# EAGLE design PiDriverV3 (EAGLE 6.4)
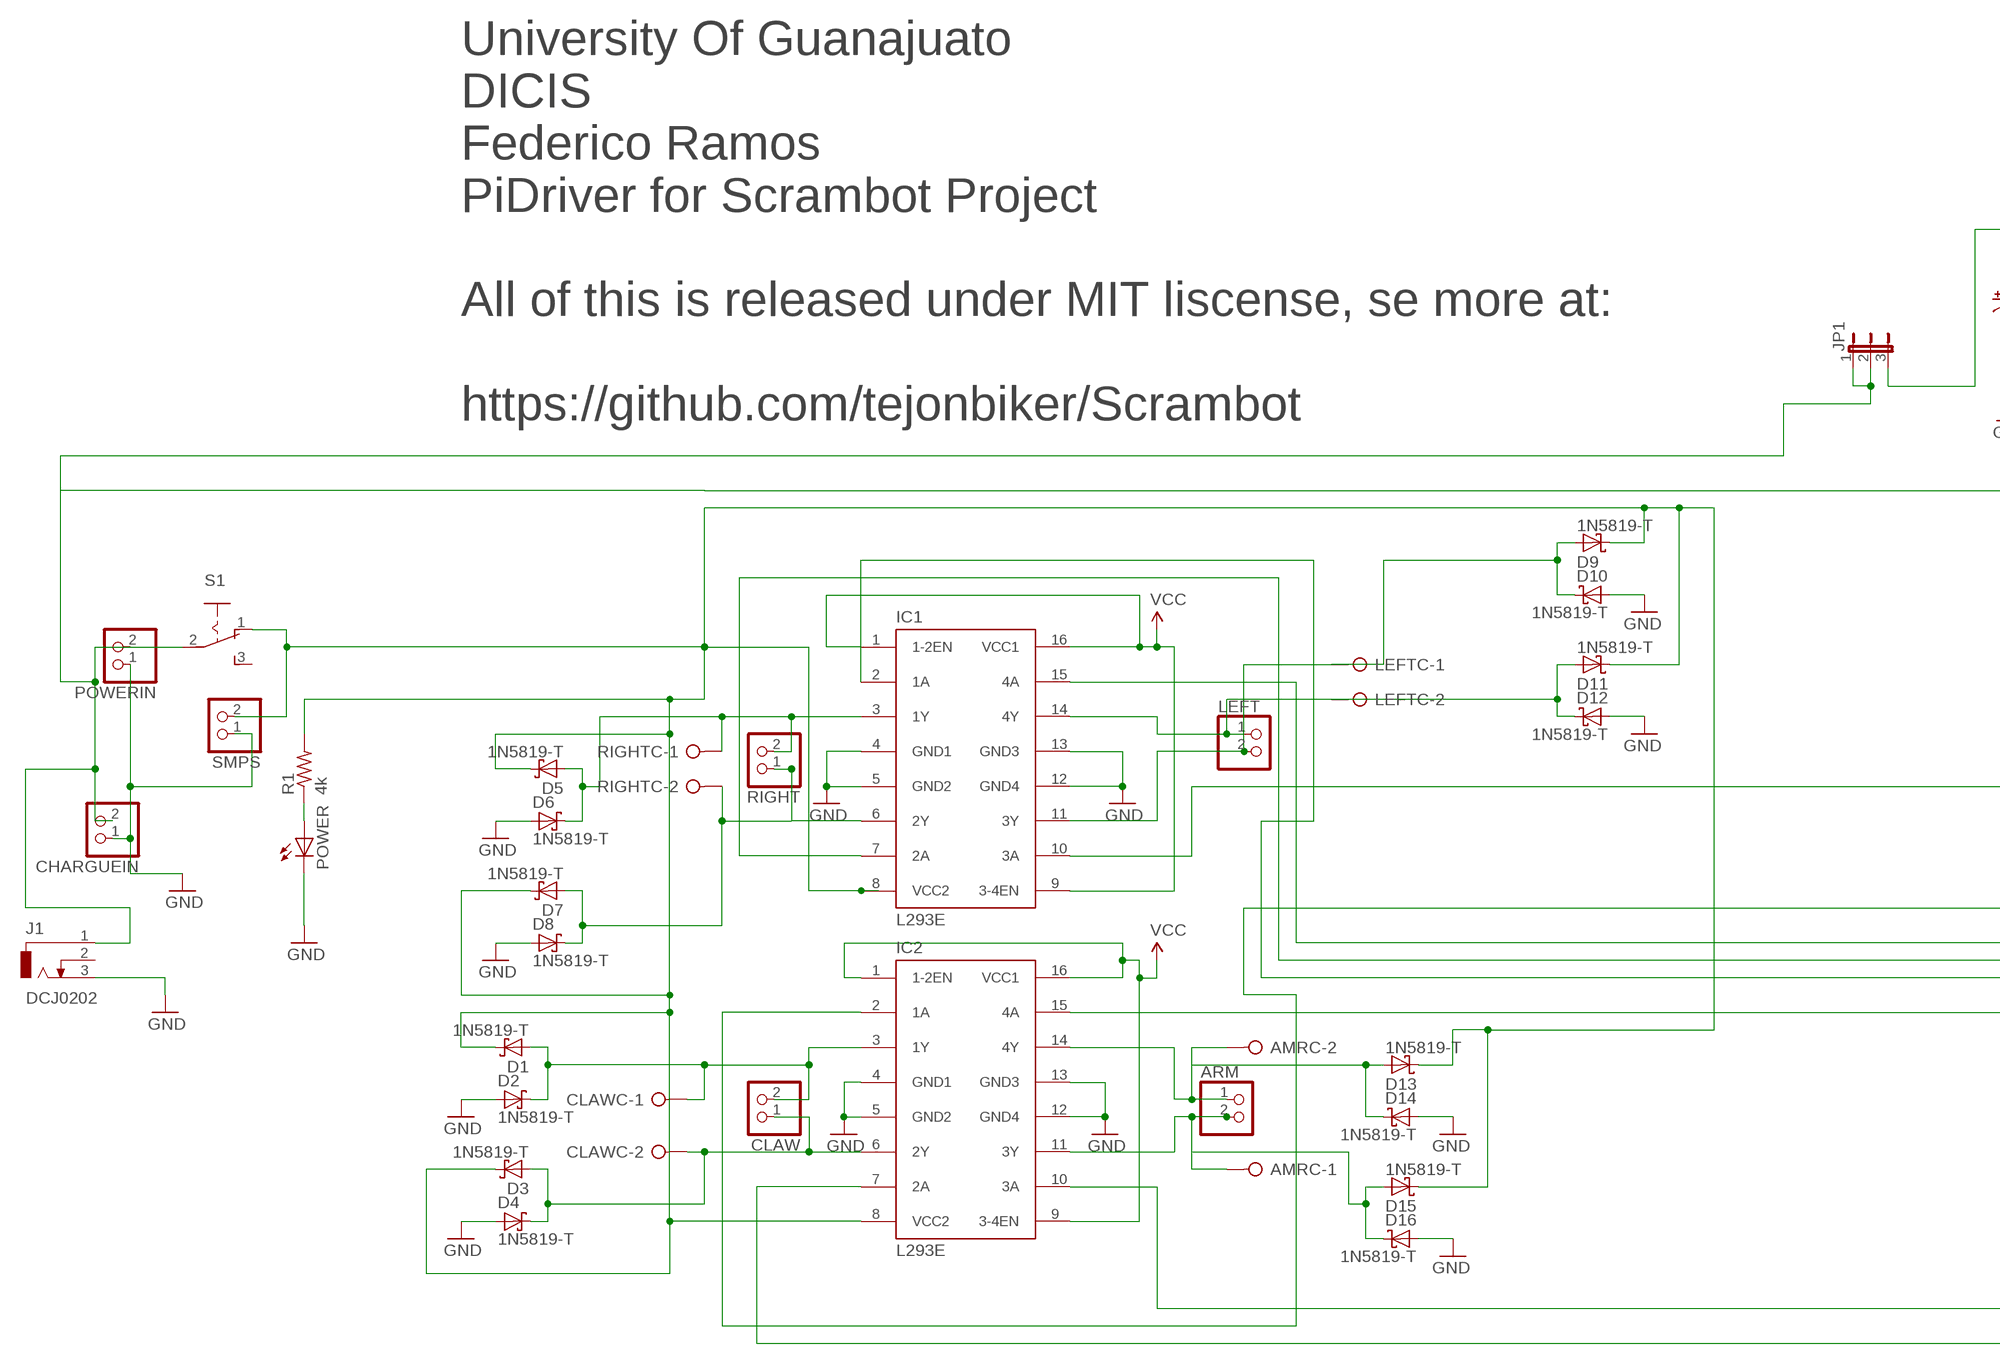
[diagram p0: schematic, sheet 1, part 1 of 2]
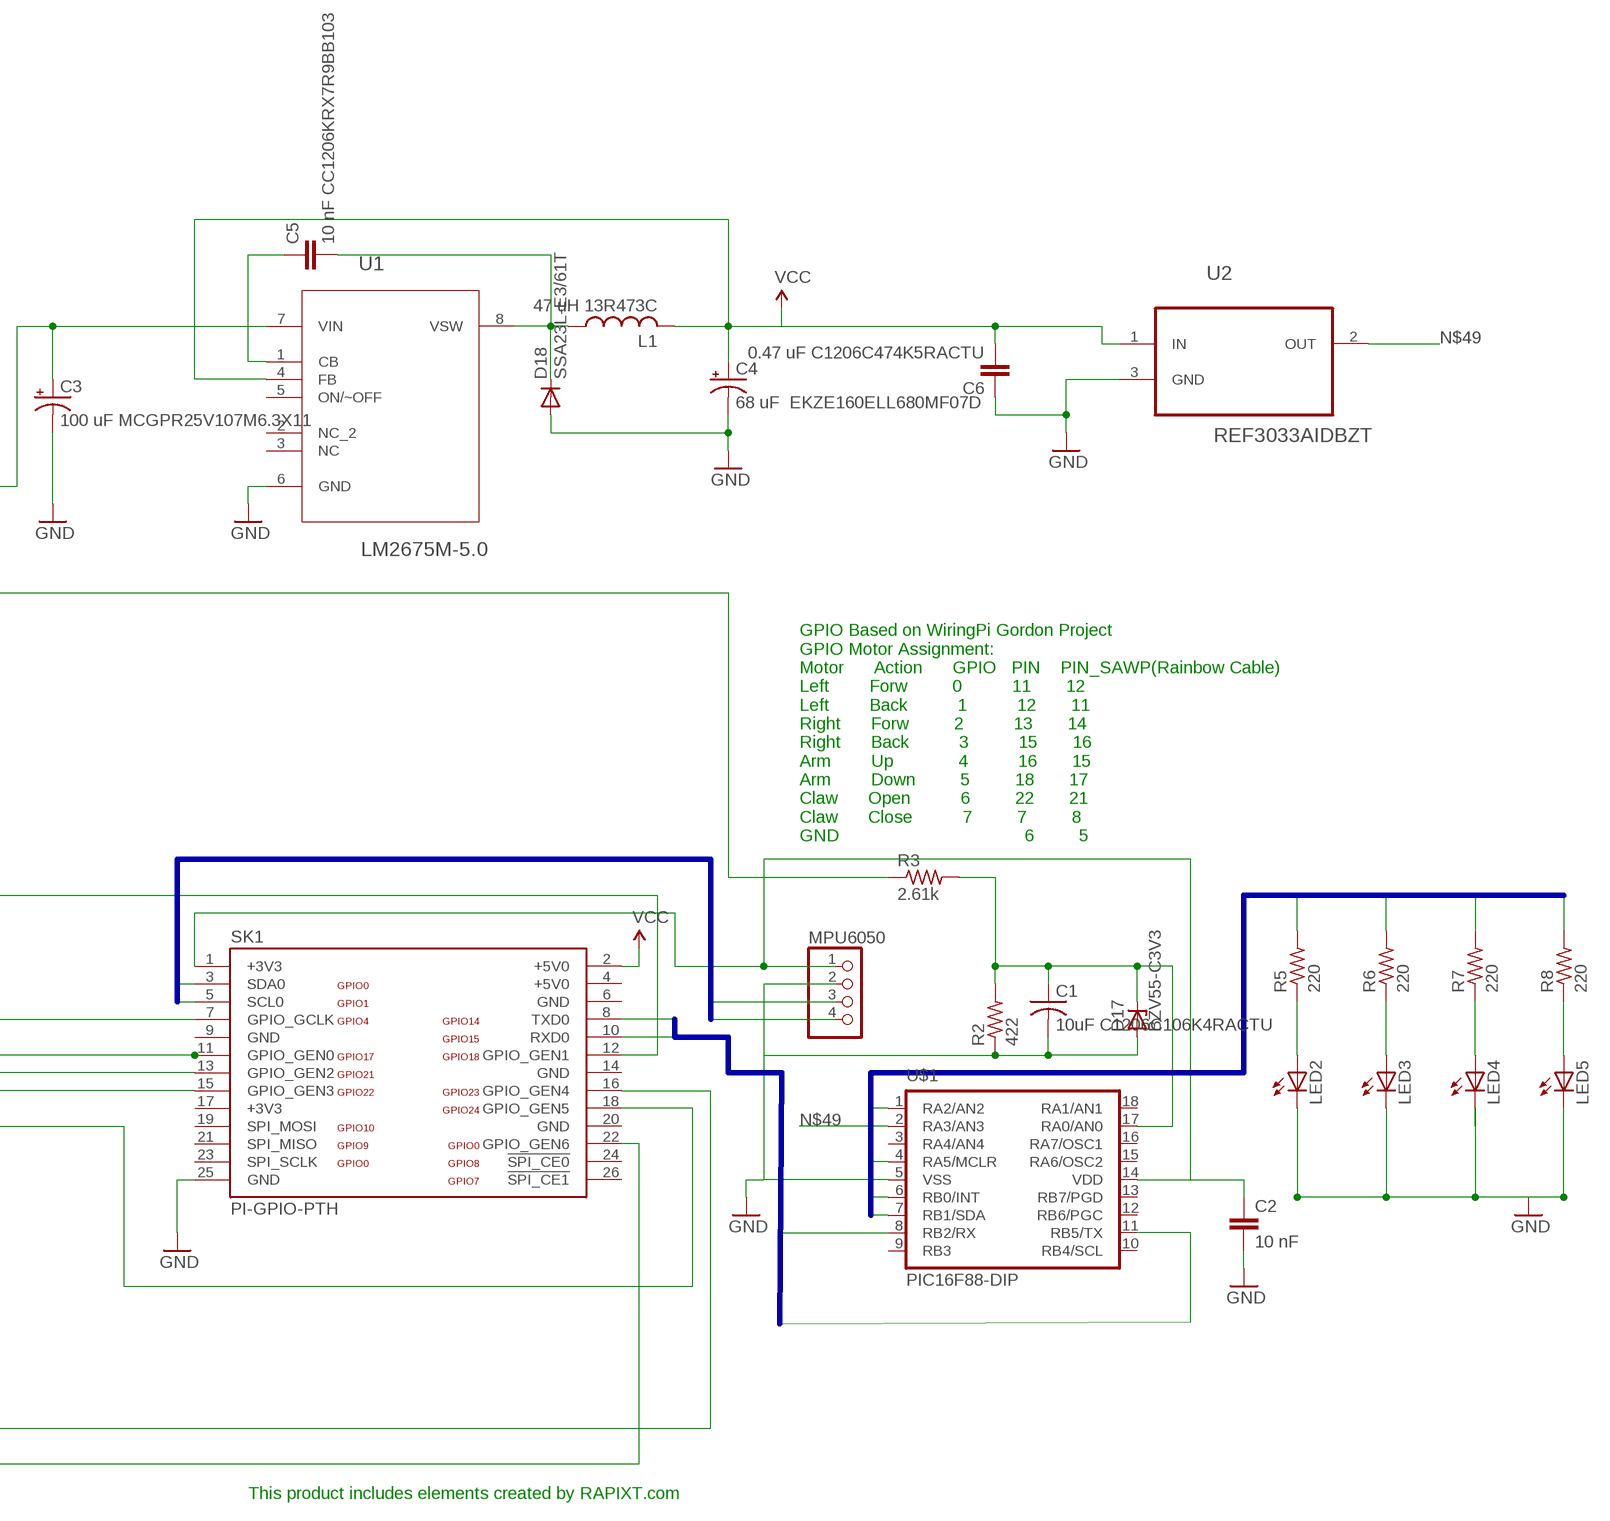
[diagram p1: schematic, sheet 1, part 2 of 2]

## Parts
AMRC  W237-02P  [W237-132]
ARM  PINHD-1X2  [1X02]
C1  10uF C1206C106K4RACTU  C-USC1206  [C1206]
C2  10 nF  C-EUC1206  [C1206]
C3  100 uF MCGPR25V107M6.3X11  CPOL-USE1.8-4  [E1,8-4]
C4  68 uF EKZE160ELL680MF07D  CPOL-USE1.8-4  [E1,8-4]
C5  10 nF CC1206KRX7R9BB103  C-EUC1206  [C1206]
C6  0.47 uF C1206C474K5RACTU  C-EUC1206  [C1206]
CHARGUEIN  PINHD-1X2  [1X02]
CLAW  PINHD-1X2  [1X02]
CLAWC  W237-02P  [W237-132]
D1  1N5819-T  [DO41-7.6]
D2  1N5819-T  [DO41-7.6]
D3  1N5819-T  [DO41-7.6]
D4  1N5819-T  [DO41-7.6]
D5  1N5819-T  [DO41-7.6]
D6  1N5819-T  [DO41-7.6]
D7  1N5819-T  [DO41-7.6]
D8  1N5819-T  [DO41-7.6]
D9  1N5819-T  [DO41-7.6]
D10  1N5819-T  [DO41-7.6]
D11  1N5819-T  [DO41-7.6]
D12  1N5819-T  [DO41-7.6]
D13  1N5819-T  [DO41-7.6]
D14  1N5819-T  [DO41-7.6]
D15  1N5819-T  [DO41-7.6]
D16  1N5819-T  [DO41-7.6]
D17  BZV55-C3V3  ZENER-DIODESOD80C  [SOD80C]
D18  SSA23L-E3/61T  DIODE-DO-214AC  [DO-214AC]
IC1  L293E  [DIL16]
IC2  L293E  [DIL16]
J1  DCJ0202  [DCJ0202]
JP1  JP2E  [JP2]
L1  47 uH 13R473C  L-US6000-XXX-RC  [6000-XXXX-RC]
LED2  LEDSMT1206  [1206]
LED3  LEDSMT1206  [1206]
LED4  LEDSMT1206  [1206]
LED5  LEDSMT1206  [1206]
LEFT  PINHD-1X2  [1X02]
LEFTC  W237-02P  [W237-132]
MPU6050  PINHD-1X4  [1X04]
POWER  LEDSMT1206  [1206]
POWERIN  PINHD-1X2  [1X02]
R1  4k  R-US_M1206  [M1206]
R2  422  R-US_M1206  [M1206]
R3  2.61k  R-US_M1206  [M1206]
R5  220  R-US_M1206  [M1206]
R6  220  R-US_M1206  [M1206]
R7  220  R-US_M1206  [M1206]
R8  220  R-US_M1206  [M1206]
RIGHT  PINHD-1X2  [1X02]
RIGHTC  W237-02P  [W237-132]
S1  255SB  [255SB]
SK1  PI-GPIO-PTH  [GPIO-CONNECTOR]
SMPS  PINHD-1X2  [1X02]
U1  LM2675M-5.0  [SOIC127P620X175-8N]
U2  REF3033AIDBZT  [SOT95P237X112-3N]
U$1  PIC16F88-DIP  [DIL18]

## Nets
ARMC: IC2.2(1A) SK1.7(GPIO_GCLK)
GND: C6.1 U2.3(GND)
HTX: SK1.8(TXD0) U$1.8(RB2/RX)
N$1: POWER.A R1.1
N$2: LED2.A R5.1
N$4: D9.A D10.C IC1.11(3Y) LEFT.2 LEFTC.1
N$6: IC2.10(3A) SK1.16(GPIO_GEN4)
N$7: IC1.2(1A) SK1.15(GPIO_GEN3)
N$8: IC1.7(2A) SK1.13(GPIO_GEN2)
N$9: IC1.10(3A) SK1.12(GPIO_GEN1)
N$10: D1.C D3.C D5.C D7.C D9.C D11.C D13.C D15.C IC1.8(VCC2) IC2.8(VCC2) R1.2 S1.1(O) SMPS.2
N$12: AMRC.2 ARM.1 D13.A D14.C IC2.14(4Y)
N$13: AMRC.1 ARM.2 D15.A D16.C IC2.11(3Y)
N$14: D11.A D12.C IC1.14(4Y) LEFT.1 LEFTC.2
N$15: R5.2 U$1.1(RA2/AN2)
N$17: C2.1 MPU6050.1 SK1.1(+3V3) U$1.14(VDD)
N$18: IC2.15(4A) SK1.18(GPIO_GEN5)
N$19: LED3.A R6.1
N$20: IC2.7(2A) SK1.22(GPIO_GEN6)
N$21: SK1.10(RXD0) U$1.11(RB5/TX)
N$23: CLAW.2 CLAWC.1 D1.A D2.C IC2.3(1Y)
N$24: D5.A D6.C IC1.3(1Y) RIGHT.2 RIGHTC.1
N$25: C5.2 D18.C L1.1 U1.8(VSW)
N$26: IC1.15(4A) SK1.11(GPIO_GEN0)
N$27: C3.+ JP1.3 U1.7(VIN)
N$28: C1.1 D17.C R2.2 R3.2 U$1.17(RA0/AN0)
N$31: R6.2 U$1.4(RA5/MCLR)
N$32: LED4.A R7.1
N$34: CLAW.1 CLAWC.2 D3.A D4.C IC2.6(2Y)
N$35: D7.A D8.C IC1.6(2Y) RIGHT.1 RIGHTC.2
N$36: LED5.A R8.1
N$40: C5.1 U1.1(CB)
N$42: R7.2 U$1.6(RB0/INT)
N$45: C1.2 C2.2 C3.- C4.- CHARGUEIN.1 D2.A D4.A D6.A D8.A D10.A D12.A D14.A D16.A D17.A D18.A IC1.4(GND1) IC1.5(GND2) IC1.12(GND4) IC1.13(GND3) IC2.4(GND1) IC2.5(GND2) IC2.12(GND4) IC2.13(GND3) J1.3 LED2.C LED3.C LED4.C LED5.C MPU6050.2 POWER.C POWERIN.1 R2.1 SK1.25(GND) SMPS.1 U1.6(GND) U$1.5(VSS) ; supply symbol labelled GND
N$48: R8.2 U$1.7(RB1/SDA)
N$49: U2.2(OUT) U$1.2(RA3/AN3)
N$53: CHARGUEIN.2 J1.1 JP1.1 JP1.2 POWERIN.2 R3.1 S1.2(P)
SCL: MPU6050.3 SK1.5(SCL0)
SDA: MPU6050.4 SK1.3(SDA0)
VCC: C4.+ C6.2 IC1.1(1-2EN) IC1.9(3-4EN) IC1.16(VCC1) IC2.1(1-2EN) IC2.9(3-4EN) IC2.16(VCC1) L1.2 SK1.2(+5V0) U1.4(FB) U2.1(IN)
Unconnected: J1.2 S1.3(S) SK1.19(SPI_MOSI) SK1.21(SPI_MISO) SK1.23(SPI_SCLK) SK1.24(!SPI_CE0) SK1.26(!SPI_CE1) U1.2(NC_2) U1.3(NC) U1.5(ON/~OFF) U$1.3(RA4/AN4) U$1.9(RB3) U$1.10(RB4/SCL) U$1.12(RB6/PGC) U$1.13(RB7/PGD) U$1.15(RA6/OSC2) U$1.16(RA7/OSC1) U$1.18(RA1/AN1)

## Buses
SCL,SDA
HTX,HRX
B$1

## Notes on the sheet
- University Of Guanajuato
  DICIS
  Federico Ramos
  PiDriver for Scrambot Project
  
  All of this is released under MIT liscense, se more at:
  
  https://github.com/tejonbiker/Scrambot
- GPIO Based on WiringPi Gordon Project
  GPIO Motor Assignment:
  Motor      Action      GPIO   PIN    PIN_SAWP(Rainbow Cable)
  Left        Forw         0          11       12
  Left        Back          1          12       11
  Right      Forw         2          13       14
  Right      Back          3          15       16
  Arm        Up             4          16       15
  Arm        Down         5         18       17
  Claw      Open          6         22       21
  Claw      Close          7         7         8
  GND                                     6         5
- This product includes elements created by RAPIXT.com

## Power pins joined to a net without a drawn wire
+3V3: SK1.17(+3V3)
+5V0: SK1.4(+5V0)
N$45: SK1.6(GND) SK1.9(GND) SK1.14(GND) SK1.20(GND)

## Library data of the parts
AMRC CLAWC LEFTC RIGHTC = con-wago-508:W237-02P: WAGO SREW CLAMP; OC_FARNELL: unknown; OC_NEWARK: unknown
ARM CHARGUEIN CLAW LEFT POWERIN RIGHT SMPS = pinhead:PINHD-1X2: PIN HEADER
C1 = rcl:C-US: CAPACITOR, American symbol
C2 C5 C6 = rcl:C-EU: CAPACITOR, European symbol
C3 C4 = rcl:CPOL-US: POLARIZED CAPACITOR, American symbol
D1-D16 = diode:1N581*: 1.0A SCHOTTKY BARRIER RECTIFIER Source: http://www.diodes.com/datasheets/ds23001.pdf
D17 = diode:ZENER-DIODE: Z-Diode
D18 = diode:DIODE-: DIODE
IC1 IC2 = texas:L293E: TI DEVICE; MF: Arrow Electronics; MPN: L293E; OC_FARNELL: 1467711; OC_NEWARK: 89K0732
J1 = con-jack:DCJ0202: DC POWER JACK Source: DCJ0202.pdf; OC_FARNELL: unknown; OC_NEWARK: unknown
JP1 = jumper:JP2E: JUMPER
L1 = rcl:L-US: INDUCTOR, American symbol
LED2-LED5 POWER = led:LED: LED OSRAM: - CHIPLED LG R971, LG N971, LY N971, LG Q971, LY Q971, LO R971, LY R971 LH N974, LH R974 LS Q976, LO Q976, LY Q976 LO Q996 - Hyper CHIPLED LW Q18S LB Q993, LB Q99A, LB R99A - SideLED LS A670, LO A670, LY A670, LG A670, LP A670 LB A673, LV A673, LT A673, LW A673 LH A674 LY A675 LS A676, LA A676, LO A676, LY A676, LW A676 LS A679, LY A679, LG A679 - Hyper Micro SIDELED® LS Y876, LA Y876, LO Y876, LY Y876 LT Y87S - SmartLED LW L88C, LW L88S LB L89C, LB L89S, LG L890 LS L89K, LO L89K, LY L89K LS L896, LA L896, LO L896, LY L896 - TOPLED LS T670, LO T670, LY T670, LG T670, LP T670 LSG T670, LSP T670, LSY T670, LOP T670, LYG T670 LG T671, LOG T671, LSG T671 LB T673, LV T673, LT T673, LW T673 LH T674 LS T676, LA T676, LO T676, LY T676, LB T676, LH T676, LSB T676, LW T676 LB T67C, LV T67C, LT T67C, LS T67K, LO T67K, LY T67K, LW E67C LS E67B, LA E67B, LO E67B, LY E67B, LB E67C, LV E67C, LT E67C LW T67C LS T679, LY T679, LG T679 LS T770, LO T770, LY T770, LG T770, LP T770 LB T773, LV T773, LT T773, LW T773 LH T774 LS E675, LA E675, LY E675, LS T675 LS T776, LA T776, LO T776, LY T776, LB T776 LHGB T686 LT T68C, LB T68C - Hyper Mini TOPLED® LB M676 - Mini TOPLED Santana® LG M470 LS M47K, LO M47K, LY M47K Source: http://www.osram.convergy.de LUXEON: - LUMILED® LXK2-PW12-R00, LXK2-PW12-S00, LXK2-PW14-U00, LXK2-PW14-V00 LXK2-PM12-R00, LXK2-PM12-S00, LXK2-PM14-U00 LXK2-PE12-Q00, LXK2-PE12-R00, LXK2-PE12-S00, LXK2-PE14-T00, LXK2-PE14-U00 LXK2-PB12-K00, LXK2-PB12-L00, LXK2-PB12-M00, LXK2-PB14-N00, LXK2-PB14-P00, LXK2-PB14-Q00 LXK2-PR12-L00, LXK2-PR12-M00, LXK2-PR14-Q00, LXK2-PR14-R00 LXK2-PD12-Q00, LXK2-PD12-R00, LXK2-PD12-S00 LXK2-PH12-R00, LXK2-PH12-S00 LXK2-PL12-P00, LXK2-PL12-Q00, LXK2-PL12-R00 Source: www.luxeon.com KINGBRIGHT: KA-3528ASYC Source: www.kingbright.com
MPU6050 = pinhead:PINHD-1X4: PIN HEADER
R1-R3 R5-R8 = rcl:R-US_: RESISTOR, American symbol
S1 = switch:255SB: SLIDING SWITCH Distributor Buerklin, 11G810
SK1 = jt-raspberry-pi:PI-: Raspberry Pi
U1 = LM2675M-5.0:LM2675M-5.0: Step-Down Voltage Regulator; MPN: LM2675M-5.0; OC_FARNELL: 9489746; OC_NEWARK: 41K4141; PACKAGE: 8-SOIC; SUPPLIER: National Semiconductors
U2 = TI-REF3033AIDBZT:REF3033AIDBZT: CMOS VOLTAGE REFERENCE; MPN: REF3033AIDBZT; OC_FARNELL: 1470325; OC_NEWARK: 75C7419; PACKAGE: SOT-23-3; SUPPLIER: Texas Instruments
U$1 = SparkFun-DigitalIC:PIC16F88-DIP: 8-bit PIC uC

## Board
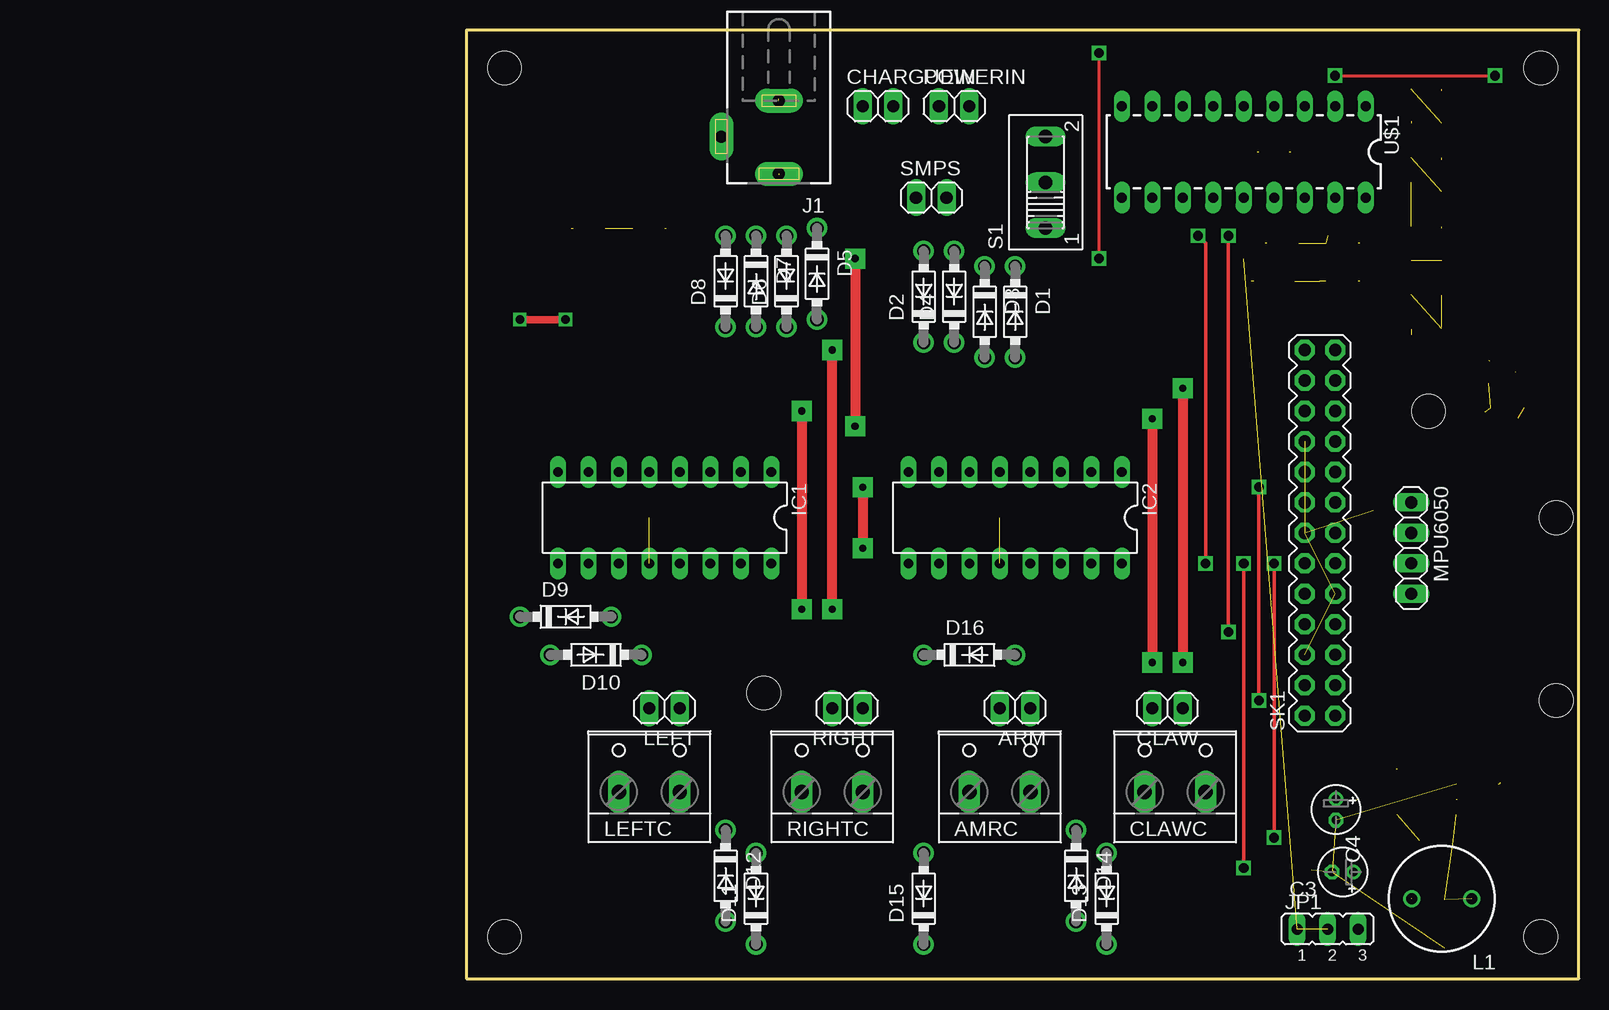
[diagram p2: board, top side]
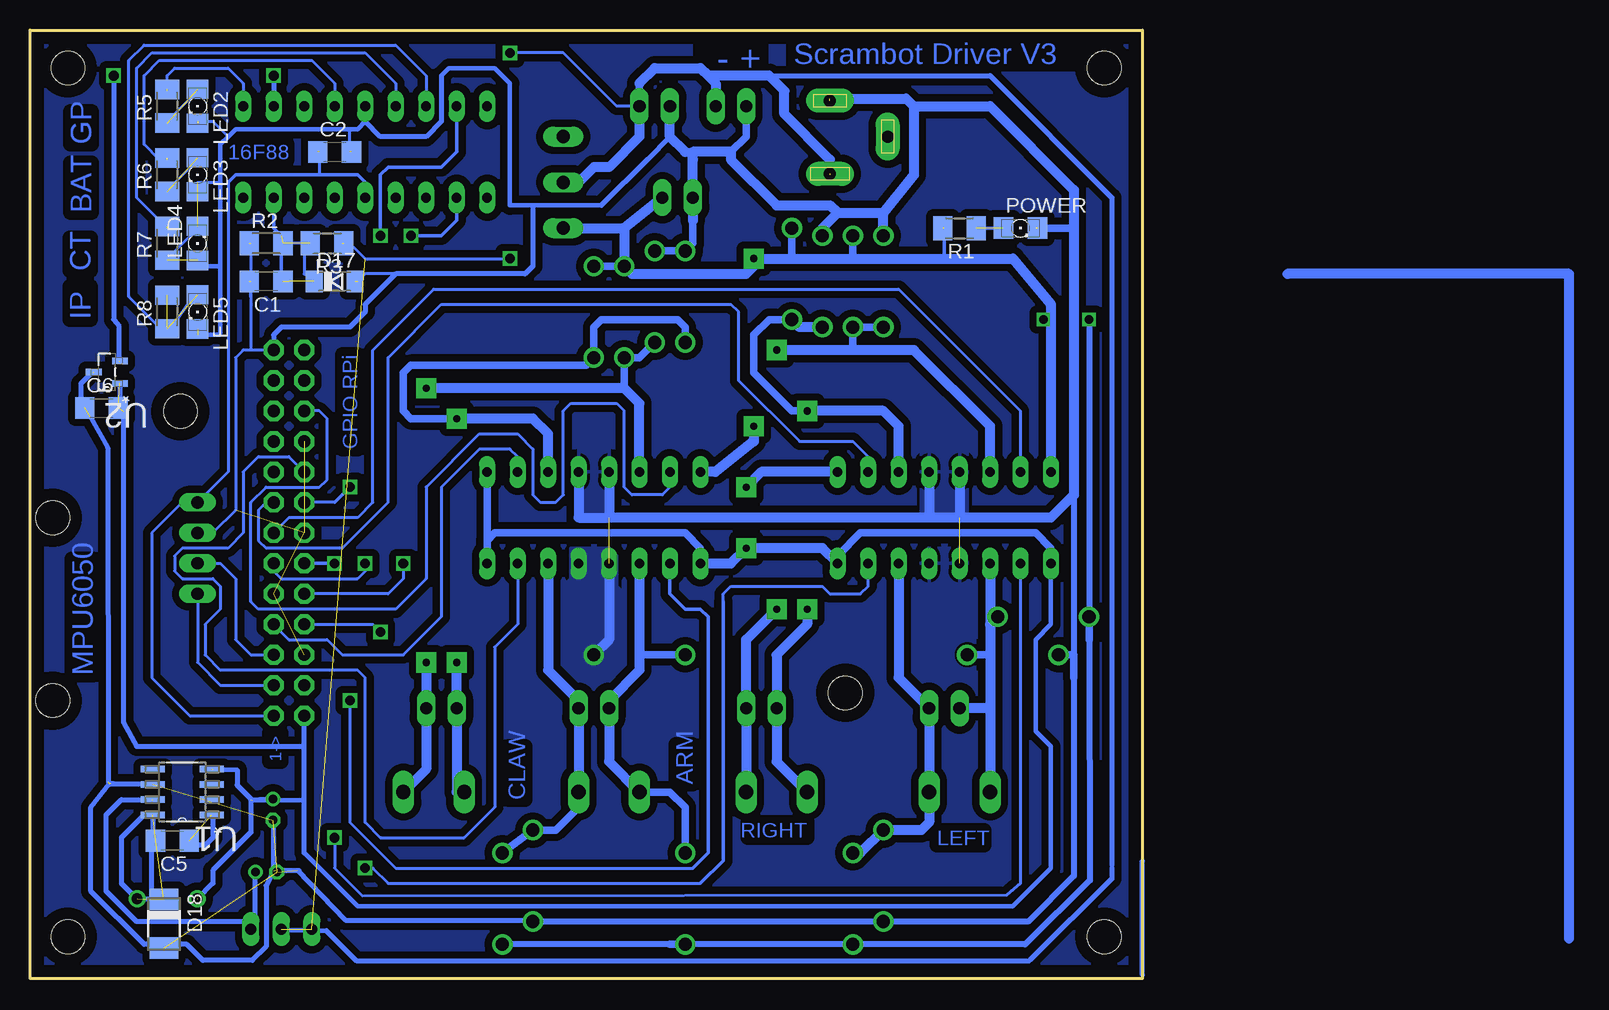
[diagram p3: board, bottom side, seen from below]

Size 92.7 x 79.05 mm. Coordinates in mm from the lower left corner, seen from the top.
Outline: 0,79.05 0,0 92.7,0 92.7,79.05 0,79.05
Copper layers (1*16): Top 0.035mm / dielectric 1.5mm / Bottom 0.035mm
Design rules "default": minimum track width 10mil, minimum drill 24mil, track to track 8mil, track to pad 8mil, pad to pad 8mil, via to via 8mil, smd to smd 8mil, copper to edge 40mil, drill to drill 8mil, minimum pad ring 10mil, minimum via ring 8mil, stop-mask expansion 4mil, vias tented up to drill 0mil, thermal gap 10mil
Holes 2.8 mm at 3.17,75.87 3.17,3.48 90.81,23.16 90.81,38.41 89.53,3.48 89.53,75.87 24.77,23.8 80.17,47.28

### Footprints (pad centres in the part's own frame; a part is rotated, then mirrored left to right if it is on the bottom)
W237-132 = drill 1.194 long: 1 -2.54,-0.635; 2 2.54,-0.635
1X02 = drill 1.016 long: 1 -1.27,0; 2 1.27,0
C1206 = smd 1.6 x 1.8: 1 -1.4,0; 2 1.4,0
E1,8-4 = drill 0.711 pad 1.168: + -0.889,0 | drill 0.711 pad 1.168 octagon: - 0.889,0
DO41-7.6 = drill 1.1 pad 1.7: A 3.81,0; C -3.81,0
SOD80C = smd 1.4 x 1.8: A 1.7,0; C -1.7,0
DO-214AC = smd 1.8 x 2.4: A 2.025,0; C -2.025,0
DIL16 = drill 0.813 long: 1 -8.89,-3.81; 2 -6.35,-3.81; 3 -3.81,-3.81; 4 -1.27,-3.81; 5 1.27,-3.81; 6 3.81,-3.81; 7 6.35,-3.81; 8 8.89,-3.81; 9 8.89,3.81; 10 6.35,3.81; 11 3.81,3.81; 12 1.27,3.81; 13 -1.27,3.81; 14 -3.81,3.81; 15 -6.35,3.81; 16 -8.89,3.81
DCJ0202 = drill 1 pad 2 long: 1 0,3.1; 2 4.8,0; 3 0,-3
JP2 = drill 0.914 long: 1 -2.54,0; 2 0,0; 3 2.54,0
6000-XXXX-RC = drill 0.9 pad 1.422: 1 -2.5,0; 2 2.5,0
1206 = smd 1.6 x 1.803: A -1.422,0; C 1.422,0
1X04 = drill 1.016 long: 1 -3.81,0; 2 -1.27,0; 3 1.27,0; 4 3.81,0
M1206 = smd 1.6 x 2: 1 -1.4,0; 2 1.4,0
255SB = drill 1.118 long: 1 -3.81,0; 2 0,0; 3 3.81,0
GPIO-CONNECTOR = drill 1.016 pad 1.676 octagon: 1 -15.24,-1.27; 2 -15.24,1.27; 3 -12.7,-1.27; 4 -12.7,1.27; 5 -10.16,-1.27; 6 -10.16,1.27; 7 -7.62,-1.27; 8 -7.62,1.27; 9 -5.08,-1.27; 10 -5.08,1.27; 11 -2.54,-1.27; 12 -2.54,1.27; 13 0,-1.27; 14 0,1.27; 15 2.54,-1.27; 16 2.54,1.27; 17 5.08,-1.27; 18 5.08,1.27; 19 7.62,-1.27; 20 7.62,1.27; 21 10.16,-1.27; 22 10.16,1.27; 23 12.7,-1.27; 24 12.7,1.27; 25 15.24,-1.27; 26 15.24,1.27
SOIC127P620X175-8N = smd 1.981 x 0.559: 1 -2.464,1.905; 2 -2.464,0.635; 3 -2.464,-0.635; 4 -2.464,-1.905; 5 2.464,-1.905; 6 2.464,-0.635; 7 2.464,0.635; 8 2.464,1.905
SOT95P237X112-3N = smd 1.321 x 0.559: 1 -1.092,0.94; 2 -1.092,-0.94; 3 1.092,0
DIL18 = drill 0.813 long: 1 -10.16,-3.81; 2 -7.62,-3.81; 3 -5.08,-3.81; 4 -2.54,-3.81; 5 0,-3.81; 6 2.54,-3.81; 7 5.08,-3.81; 8 7.62,-3.81; 9 10.16,-3.81; 10 10.16,3.81; 11 7.62,3.81; 12 5.08,3.81; 13 2.54,3.81; 14 0,3.81; 15 -2.54,3.81; 16 -5.08,3.81; 17 -7.62,3.81; 18 -10.16,3.81

### Placement (x,y rotation side)
AMRC  44.45,16.18 0 top
ARM  45.72,22.53 180 top
C1  73.03,58.09 180 bottom
C2  67.31,68.89 0 bottom
C3  73.03,8.88 180 top
C4  72.45,14.08 270 top
C5  80.84,11.48 180 bottom
C6  86.74,47.55 0 bottom
CHARGUEIN  34.29,72.7 0 top
CLAW  58.42,22.53 180 top
CLAWC  59.05,16.18 0 top
D1  45.72,55.55 270 top
D2  38.1,56.82 90 top
D3  43.18,55.55 270 top
D4  40.64,56.82 90 top
D5  29.21,58.73 270 top
D6  26.67,58.09 90 top
D7  24.13,58.09 270 top
D8  21.59,58.09 90 top
D9  8.26,30.15 0 top
D10  10.79,26.98 180 top
D11  24.13,6.65 90 top
D12  21.59,8.56 270 top
D13  53.34,6.65 90 top
D14  50.8,8.56 270 top
D15  38.1,6.65 90 top
D16  41.91,26.98 0 top
D17  67.31,58.09 0 bottom
D18  81.53,4.56 270 bottom
IC1  16.51,38.41 180 top
IC2  45.72,38.41 180 top
J1  26.04,70.16 180 top
JP1  71.75,4.12 0 top
L1  81.28,6.65 180 top
LED2  78.74,72.7 270 bottom
LED3  78.74,66.98 270 bottom
LED4  78.74,61.27 90 bottom
LED5  78.74,55.55 270 bottom
LEFT  16.51,22.53 180 top
LEFTC  15.24,16.18 0 top
MPU6050  78.74,35.87 270 top
POWER  10.16,62.53 0 bottom
POWERIN  40.64,72.7 0 top
R1  15.24,62.53 180 bottom
R2  73.03,61.27 0 bottom
R3  67.94,61.27 180 bottom
R5  81.28,72.7 90 bottom
R6  81.28,66.98 90 bottom
R7  81.28,61.27 90 bottom
R8  81.28,55.55 90 bottom
RIGHT  31.75,22.53 180 top
RIGHTC  30.48,16.18 0 top
S1  48.26,66.35 90 top
SK1  71.12,37.13 90 top
SMPS  38.73,65.08 0 top
U1  80.01,15.54 180 bottom
U2  86.3,50.53 180 bottom
U$1  64.77,68.89 180 top

### Tracks (layer width: path | path; a pad name or v marks a point on that pad's centre or on a via)
ARMC
  Bottom 0.254: IC2.2 52.07,43.48 52.7,44.12 55.24,44.12 58.42,40.95 58.42,30.15 61.59,26.98 66.67,26.98 67.94,28.25 71.12,28.25 SK1.7
GND  (6 unrouted)
  Bottom 0.406: 82.8,16.24 86.11,16.24 87.63,14.28 87.63,7.29 83.19,2.85 79.63,2.85 78.3,1.51 74.17,1.51 73.03,2.65 73.03,7.73 72.39,8.94 72.39,13.2 | 72.14,9 70.29,9 | 85.79,16.24 85.98,16.24 | 87.63,46.72 86.23,44.25 86.17,16.37 | 87.44,50.53 87.5,50.53 88.46,49.58 88.46,47.87 C6.1
HTX  (via drill 0.8)
  Top 0.305: v63.5,28.88 v63.5,61.9
  Bottom 0.254: SK1.8 64.14,29.52 v63.5,28.88
  Bottom 0.305: U$1.8 57.15,68.89 58.42,67.62 62.87,67.62 63.5,66.98 v63.5,61.9
N$1  (1 unrouted)
N$2  (1 unrouted)
N$4
  Bottom 0.61: D9.A 12.7,29.52 | D10.C 12.7,26.98
  Bottom 0.813: IC1.11 12.7,29.52 12.7,26.98 12.7,22.53 | 12.7,22.53 LEFT.2 | 12.7,22.53 LEFTC.1
N$5
  Bottom 0.305: 13.97,62.53 11.43,62.53
N$6  (via drill 0.8)
  Top 0.305: v66.04,23.16 v66.04,40.95
  Bottom 0.254: v66.04,23.16 66.04,13 62.23,9.2 37.47,9.2 | 67.31,39.67 SK1.16
  Bottom 0.305: 37.47,9.2 36.2,10.46 36.2,30.15 36.83,30.79 38.1,30.79 39.37,32.05 IC2.10 | v66.04,40.95 67.31,39.67
N$7
  Bottom 0.254: IC1.2 22.86,43.48 24.13,44.76 28.57,44.76 33.66,49.84 33.66,55.55 34.29,56.19 58.42,56.19 62.87,51.74 62.87,39.67 66.67,35.87 73.03,35.87 73.66,36.5 73.66,39.04 73.03,39.67 SK1.15
N$8
  Bottom 0.254: IC1.7 10.16,47.3 20.32,57.45 59.05,57.45 64.14,52.38 64.14,39.67 65.41,38.41 71.12,38.41 SK1.13
N$9  (via drill 0.8)
  Top 0.305: v67.31,11.73 v67.31,34.59
  Bottom 0.254: v67.31,11.73 67.31,9.2 65.02,6.91 11.3,6.97 10.16,7.92 IC1.10
  Bottom 0.305: v67.31,34.59 SK1.12
N$10  (via drill 0.6 pad 1.68, 0.7)  (1 unrouted)
  Top 0.61: v8.26,54.91 v4.45,54.91
  Top 0.813: v32.38,59.99 v32.38,46.02
  Bottom 0.305: 16.51,59.99 16.51,62.53
  Bottom 0.483: v4.45,54.91 D9.C | 4.45,28.25 4.38,8.18 9.78,2.85 D11.C D15.C | 39.37,2.85 D13.C
  Bottom 0.61: 42.55,58.73 D3.C D1.C | D5.C 29.21,59.99 | D7.C 24.13,59.99 | v8.26,54.91 7.62,54.91 | D9.C 4.45,28.25 | D15.C 39.37,2.85
  Bottom 0.813: 43.18,62.53 D3.C | 42.55,58.73 33.02,58.73 32.38,59.36 v32.38,59.99 29.21,59.99 24.13,59.99 16.51,59.99 10.79,59.99 7.62,56.19 7.62,54.91 IC1.8 | v32.38,46.02 32.38,44.76 35.56,42.21 IC2.8 | S1.1 43.18,62.53 | SMPS.2 43.18,62.53
N$11
  pour Bottom (isolate 0.61): 92.71,79.05 0,79.05 0,-0.33 92.71,-0.33
N$12
  Bottom 0.61: AMRC.2 46.99,14.28 48.9,12.37 D14.C D13.A
  Bottom 0.813: IC2.14 49.53,25.7 46.99,23.16 ARM.1 AMRC.2
N$13
  Bottom 0.61: D16.C 41.91,26.98 | D15.A 38.1,14.28 39.37,15.54 AMRC.1
  Bottom 0.813: IC2.11 41.91,26.98 41.91,25.7 44.45,23.16 ARM.2 44.45,18.09 AMRC.1
N$14
  Bottom 0.813: IC1.14 20.32,25.07 LEFT.1 LEFTC.2 17.78,13 18.41,12.37 D12.C 23.5,10.46 D11.A
N$15  (1 unrouted)
  Bottom 0.254: 81.28,73.97 81.28,75.24 80.64,75.87 76.2,75.87 74.93,74.6 U$1.1
N$16
  Bottom 0.254: 71.12,61.27 69.85,61.27 69.85,58.73 69.22,58.09
N$17  (1 unrouted)
  Bottom 0.254: SK1.1 79.38,21.89 82.55,25.07 82.55,37.13 80.01,39.67 MPU6050.1 76.2,42.21 76.2,66.35 | 68.58,68.89 68.58,66.98
  Bottom 0.305: 76.2,66.35 75.56,66.98 68.58,66.98 65.41,66.98 64.77,66.35 U$1.14
N$18
  Bottom 0.254: SK1.18 71.12,43.48 73.66,43.48 74.93,42.21 74.93,37.13 76.2,35.87 80.01,35.87 80.64,35.23 80.64,33.96 80.01,33.33 77.47,33.33 76.83,32.69 76.83,30.79 78.11,29.52 78.11,26.98 76.83,25.7 65.41,25.7 64.77,25.07 64.77,13 63.5,11.73 56.52,11.73 53.98,14.28 53.98,27.61 52.07,29.52 IC2.15
N$19  (1 unrouted)
N$20
  Bottom 0.254: SK1.22 68.58,47.3 67.94,46.66 67.94,41.58 68.58,40.95 73.03,40.95 74.3,39.67 74.3,31.42 73.66,30.79 62.23,30.79 59.69,33.33 59.69,40.95 55.24,45.39 52.07,45.39 50.8,44.12 50.8,40.31 50.16,39.67 48.9,39.67 48.26,40.31 48.26,47.3 47.62,47.93 43.81,47.93 43.18,47.3 43.18,40.95 42.55,40.31 40.01,40.31 39.37,40.95 IC2.7
N$21  (via drill 0.8)
  Top 0.305: v61.59,34.59 61.59,61.27 v60.96,61.9
  Bottom 0.254: v61.59,34.59 61.59,33.33 62.87,32.05 SK1.10
  Bottom 0.305: U$1.11 57.15,63.17 58.42,61.9 v60.96,61.9
N$22
  Bottom 0.813: -35.56,3.33 -35.56,58.73 -12.08,58.73
N$23  (via drill 0.6 pad 1.68)
  Top 0.813: v57.15,46.66 v57.15,26.34
  Bottom 0.61: D2.C 38.1,54.28 38.73,54.91 45.09,54.91 45.72,54.28 D1.A 46.35,51.1 60.96,51.1 61.59,50.47 61.59,47.3 60.96,46.66 v57.15,46.66
  Bottom 0.813: IC2.3 49.53,45.39 50.8,46.66 v57.15,46.66 | v57.15,26.34 CLAW.2 57.15,15.54 CLAWC.1
N$24  (via drill 0.6 pad 1.68)
  Top 0.813: v27.94,47.3 v27.94,30.79
  Bottom 0.61: D5.A 31.11,54.91 32.38,53.65 32.38,50.47 29.21,47.3 v27.94,47.3
  Bottom 0.813: IC1.3 20.32,46.02 21.59,47.3 v27.94,47.3 | v27.94,30.79 27.94,29.52 30.48,26.98 RIGHT.2 30.48,18.09 RIGHTC.1 | D6.C 28.57,54.28 D5.A
N$25  (3 unrouted)
N$26  (via drill 0.8)
  Top 0.305: v64.77,34.59 v64.77,9.2
  Bottom 0.254: v64.77,9.2 64.14,9.2 62.87,7.92 36.83,7.92 | SK1.11 72.39,33.96 71.75,33.33 65.41,33.33 64.77,33.96 v64.77,34.59 | 34.92,31.42 34.92,32.05 34.29,32.69 26.67,32.69 26.04,32.05 23.5,32.05 22.86,32.69 IC1.15
  Bottom 0.305: 36.83,7.92 34.92,9.83 34.92,31.42 | 22.86,33.33 IC1.15
N$27  (1 unrouted)
  Bottom 0.406: JP1.3 74.23,3.35 73.91,3.73 73.91,4.75 | 73.91,4.75 C3.+ | 73.91,4.75 83.82,4.75 86.36,7.29 86.36,13.64 85.09,14.91 82.55,14.91
N$28  (4 unrouted)
  Bottom 0.305: 71.12,58.09 71.75,57.45 71.75,61.9 72.39,62.53 U$1.17
N$30
  Bottom 0.254: 78.74,73.97 81.28,71.43
N$31  (1 unrouted)
  Bottom 0.254: 81.28,68.25 81.92,68.25 83.19,69.52 83.19,75.24 81.92,76.51 69.22,76.51 67.31,74.6 U$1.4
N$32  (1 unrouted)
N$33
  Bottom 0.254: 78.74,68.25 81.28,65.71
N$34  (via drill 0.6 pad 1.68)
  Top 0.813: v59.69,49.2 v59.69,26.34
  Bottom 0.61: D4.C 41.91,51.74 D3.A 43.18,49.2
  Bottom 0.813: IC2.6 41.91,47.93 43.18,49.2 v59.69,49.2 | v59.69,26.34 CLAW.1 59.69,17.45 CLAWC.2
N$35  (via drill 0.6 pad 1.68)
  Top 0.813: v30.48,30.79 v30.48,52.38
  Bottom 0.61: D8.C D7.A 24.13,52.38
  Bottom 0.813: IC1.6 12.7,46.02 19.05,52.38 24.13,52.38 v30.48,52.38 | v30.48,30.79 33.02,28.25 RIGHT.1 RIGHTC.2
N$36  (1 unrouted)
N$37
  Bottom 0.254: 78.74,62.53 81.28,59.99
N$38
  Bottom 0.254: 78.74,57.45 81.28,53.65
N$39
  Bottom 0.406: 0,0.3 0,9.8
N$40  (1 unrouted)
N$41
  Bottom 0.406: 82.42,11.48 82.42,13.58 82.49,13.64
N$42  (1 unrouted)
  Bottom 0.254: 81.28,62.53 83.82,65.08 83.82,75.87 82.55,77.14 64.77,77.14 62.23,74.6 U$1.6
N$43
  Bottom 0.406: 82.55,13.64 83.19,13.64 85.09,11.73 85.09,7.92 83.82,6.65 82.55,6.65 | 82.42,11.35 82.55,11.23 82.55,6.65 | 82.55,6.65 81.66,6.65 81.6,6.72
N$44
  Bottom 0.406: 77.47,13.64 77.47,11.73 78.11,11.1 80.01,11.1
N$45  (20 unrouted)
  Bottom 0.254: SK1.25 74.3,52.38 | 74.3,52.38 74.93,52.38 75.56,51.74 75.56,39.04 77.47,37.13 MPU6050.2 | 74.3,61.27 74.3,58.09 | 74.3,56.82 74.3,52.38 | 78.74,66.35 76.83,66.35 | 62.23,58.73 64.77,58.73 65.41,58.09 | 78.74,71.43 77.47,71.43 76.2,70.16 | 66.04,68.89 66.04,70.79
  Bottom 0.305: 74.3,58.09 74.3,56.82
  Bottom 0.381: 38.1,68.89 37.47,68.25 | 45.09,64.44 50.8,64.44 52.7,64.44 52.7,74.6 53.98,75.87 57.78,75.87 58.42,75.24 | U$1.5 64.77,71.43 65.41,70.79 66.04,70.79 75.56,70.79 76.2,70.16 76.83,69.52 76.83,66.35 76.83,59.36 | 76.83,59.36 76.83,53.65 78.74,53.65 | 78.74,59.36 76.83,59.36
  Bottom 0.406: 70.42,9 66.42,4.88 50.8,4.88 | 45.09,64.44 41.27,68.25 39.37,70.16 | SK1.25 72.39,53.65 71.75,54.28 66.04,54.28 64.77,55.55 64.77,56.19 62.23,58.73 51.44,58.73 50.8,59.36 50.8,64.44 | 58.42,75.24 58.42,71.43 59.69,70.16 63.5,70.16 64.77,71.43
  Bottom 0.483: 5.71,40.31 5.71,26.98 | 5.71,25.07 5.71,8.56 9.53,4.75 D12.A 50.67,4.75 D14.A
  Bottom 0.61: CHARGUEIN.1 33.02,70.16 34.29,68.89 | 37.47,68.89 38.1,68.89 | 8.89,62.53 5.71,62.53 | 37.47,63.8 37.47,61.27 D2.A D4.A | D10.A 5.71,26.98 5.71,25.07 | D6.A 26.67,62.53 | 50.8,4.88 50.67,4.75
  Bottom 0.813: 38.1,68.89 39.37,70.16 POWERIN.1 | 19.05,72.7 12.7,72.7 5.71,65.71 5.71,62.53 5.71,40.31 7.62,38.41 15.24,38.41 | 15.24,38.41 17.78,38.41 | 17.78,38.41 44.45,38.41 | IC1.4 17.78,38.41 | IC1.5 15.24,38.41 | IC2.5 44.45,38.41 | 44.45,38.41 46.99,38.41 IC2.4 | 37.47,63.17 37.47,63.8 SMPS.1 37.47,68.25 37.47,68.89 34.29,68.89 34.29,68.25 30.48,64.44 26.04,64.44 25.4,63.8 | D8.A 21.59,63.8 | IC2.12 44.45,28.25 D16.A | 26.67,62.53 25.4,63.8 | 25.4,63.8 21.59,63.8 | 19.05,72.7 19.05,66.98 21.59,63.8 | 26.04,73.33 19.68,73.33 19.05,72.7
  pour Bottom (no thermals): 48.26,26.98 48.26,32.69 47.62,33.33 47.62,35.87 44.45,35.87 43.81,35.23 43.81,32.69 43.18,32.05 43.18,26.34 44.45,25.07 46.99,25.07 47.62,25.7
  pour Bottom: 46.99,38.41 44.45,38.41 44.45,46.02 45.09,46.66 46.35,46.66 46.99,46.02
  pour Bottom: 14.61,38.41 14.61,46.02 19.68,51.1 22.23,51.1 22.23,48.56 20.95,48.56 18.41,46.02 18.41,38.41
  pour Bottom: 18.41,35.87 18.41,33.33 19.05,32.69 19.05,25.7 18.41,25.07 13.97,25.07 13.97,32.69 14.61,33.33 14.61,35.87
N$46
  Bottom 0.406: 2.54,9.2 2.54,8.31 9.34,1.57
N$47
  Bottom 0.406: 9.46,1.45 65.47,1.45 68.01,3.99 71.88,4.05
N$48  (1 unrouted)
  Bottom 0.254: 81.28,54.28 81.92,54.28 84.45,56.82 84.45,76.51 83.19,77.78 62.23,77.78 59.69,75.24 U$1.7
N$49  (via drill 0.8)  (1 unrouted)
  Top 0.254: v72.39,75.24 v85.72,75.24
  Bottom 0.406: 85.28,51.42 85.28,54.34 85.72,54.91 v85.72,75.24 | v72.39,75.24 U$1.2
N$52
  Bottom 0.406: 85.22,49.58 85.22,47.61 85.34,47.49
N$53  (via drill 0.8)  (4 unrouted)
  Top 0.254: v52.7,77.14 v52.7,59.99
  Bottom 0.254: POWERIN.2 43.81,72.7 48.26,77.14 v52.7,77.14 | 66.67,61.27 66.04,61.27 64.77,59.99 v52.7,59.99
  Bottom 0.406: 31.75,75.24 12.7,75.24 2.54,65.08 2.54,9.45
  Bottom 0.61: POWERIN.2 41.91,74.6 | 46.99,66.35 S1.2
  Bottom 0.813: 26.04,66.98 26.04,68.25 29.84,72.06 29.84,73.97 31.11,75.24 31.75,75.24 36.2,75.24 | 41.91,74.6 40.64,75.87 36.83,75.87 36.2,75.24 | 36.2,75.24 35.56,74.6 CHARGUEIN.2 | POWERIN.2 41.91,70.16 44.45,67.62 45.72,67.62 46.99,66.35
SCL
  Bottom 0.254: MPU6050.3 76.83,34.59 75.56,33.33 75.56,28.25 74.3,26.98 SK1.5
SDA
  Bottom 0.254: MPU6050.4 78.74,26.34 76.83,24.43 SK1.3
VCC  (via drill 0.6 pad 1.68)  (5 unrouted)
  Top 0.813: v33.02,40.95 v33.02,35.87
  Bottom 0.356: IC1.9 7.62,29.52 8.89,28.25 8.89,20.62 7.62,19.36 7.62,9.2 10.79,6.02 65.41,6.02 69.85,10.46
  Bottom 0.406: 74.3,14.91 74.3,12.18 77.47,9 77.47,7.92 78.74,6.65 | 69.85,10.46 69.85,14.91 | 69.85,14.91 69.85,19.36 | 69.85,19.36 SK1.2 | 77.47,17.45 75.44,17.39 75.44,16.12 74.17,14.85 | 74.17,14.85 69.85,14.91 | C4.+ 74.17,14.85 | 69.85,19.36 83.82,19.36 84.9,21.32 84.9,47.23
  Bottom 0.61: IC2.9 36.83,35.87 38.1,37.13 53.98,37.13 54.61,36.5 IC2.16 IC2.1 | IC1.16 25.4,35.23 23.5,37.13 8.89,37.13 7.62,35.87 IC1.9
  Bottom 0.813: IC2.9 34.29,34.59 v33.02,35.87 26.67,35.87 IC1.16 | IC1.1 31.75,42.21 v33.02,40.95

### Text on the board
Bottom: - + | Scrambot Driver V3 | GP | 16F88 | BAT | CT | IP | GPIO RPi | MPU6050 | 1-> | ARM | CLAW | RIGHT | LEFT